# Altium schematic sheet fpga.SchDoc: FPGA
size A4; Organization: GPA & FRYK Industries; DocumentNumber: 3; Revision: REV 0; SheetNumber: 3; SheetTotal: 6
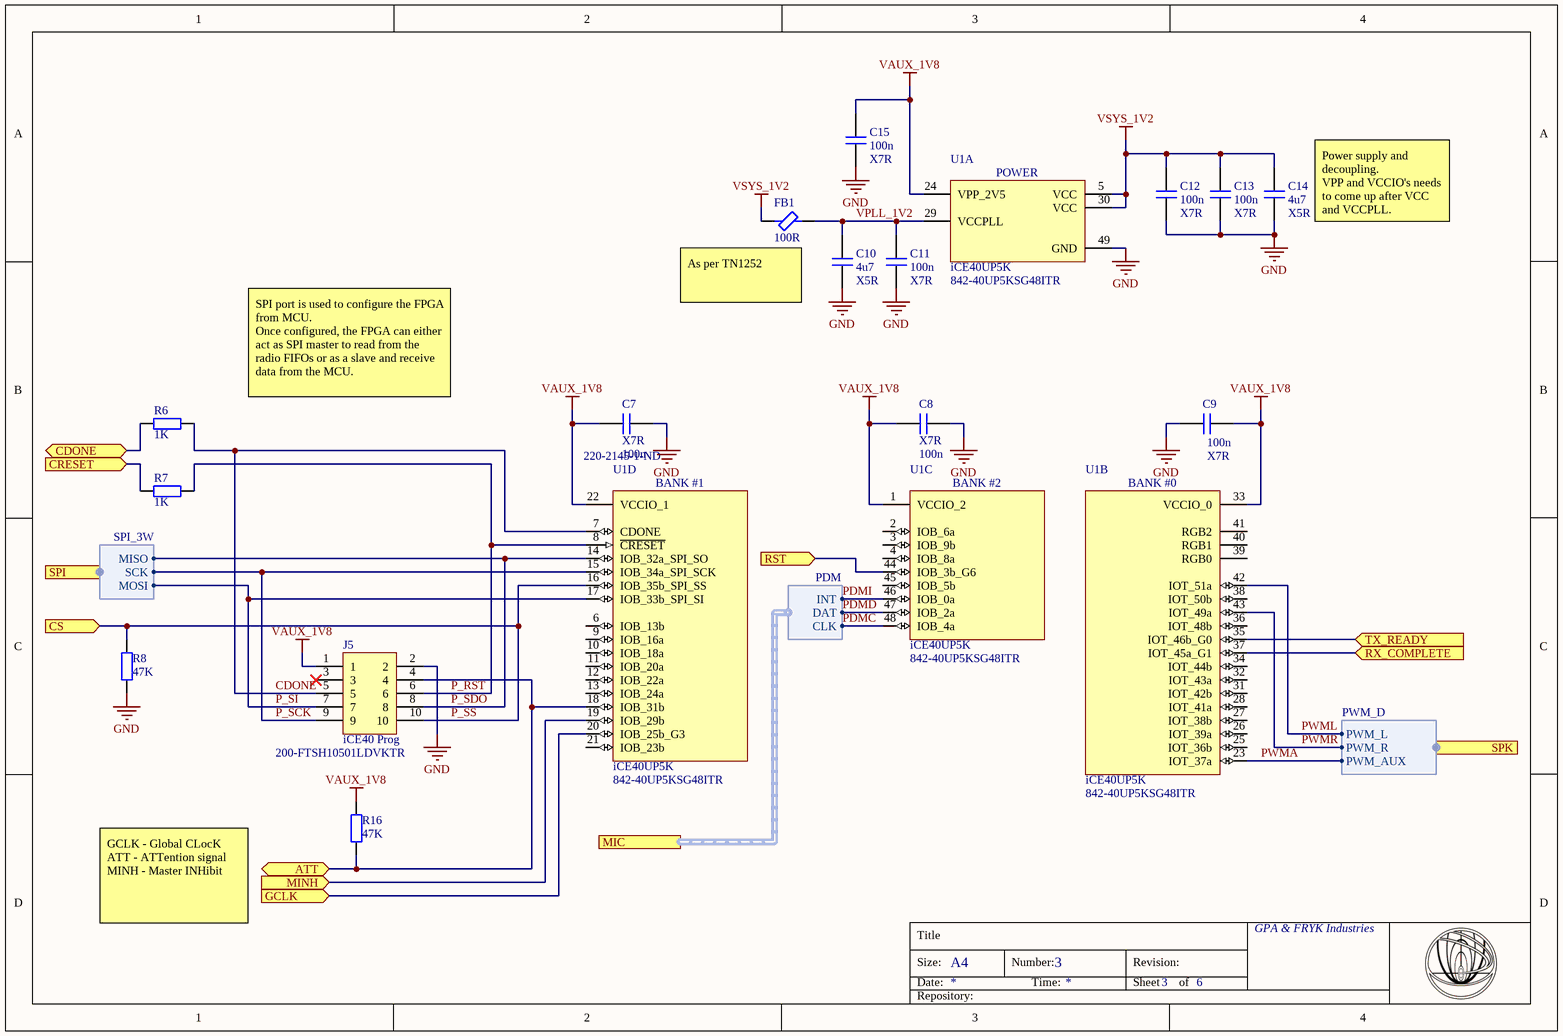
[diagram p0: fpga.SchDoc]

## Parts
C7  value 100n  type: X7R  [CAPC1005X06N]  (hidden comment: cap)
C8  value 100n  type: X7R  [CAPC1005X06N]  (hidden comment: cap)
C9  value 100n  type: X7R  [CAPC1005X06N]  (hidden comment: cap)
C10  value 4u7  type: X5R  [CAPC2012X11N]  (hidden comment: cap)
C11  value 100n  type: X7R  [CAPC1005X06N]  (hidden comment: cap)
C12  value 100n  type: X7R  [CAPC1005X06N]  (hidden comment: cap)
C13  value 100n  type: X7R  [CAPC1005X06N]  (hidden comment: cap)
C14  value 4u7  type: X5R  [CAPC2012X11N]  (hidden comment: cap)
C15  value 100n  type: X7R  [CAPC1005X06N]  (hidden comment: cap)
FB1  value 100R  [INDC1005X06N]  (hidden comment: ferrite)
J5  iCE40 Prog  Supplier Part Number 1: 200-FTSH10501LDVKTR  [hdr_2x5_50mil]
R6  value 1K  [RESC1005X04N]  (hidden comment: res)
R7  value 1K  [RESC1005X04N]  (hidden comment: res)
R8  value 47K  [RESC1005X04N]  (hidden comment: res)
R16  value 47K  [RESC1005X04N]  (hidden comment: res)
U1  iCE40UP5K  Supplier Part Number 1: 842-40UP5KSG48ITR  [QFN127P600-8N-ICE40UP5K]  (parts A,B,C,D of 4)

## Ports
ATT (bidir), CDONE (bidir), CRESET (in), CS (in), GCLK (in), MIC (harness PDM), MINH (in), RST (in), RX_COMPLETE (in), SPI (harness SPI_3W), SPK (harness PWM_D), TX_READY (in)

## Harnesses
SPI_3W: MOSI, MISO, SCK
PWM_D: PWM_R, PWM_L, PWM_AUX
PDM: DAT, CLK, INT

## Nets
GND: C7.1 C8.1 C9.1 C10.1 C11.1 C12.2 C13.2 C14.1 C15.1 J5.2 R8.1 U1.49(GND)
VAUX_1V8: C7.2 C8.2 C9.2 C15.2 J5.1 R16.2 U1.1(VCCIO_2) U1.22(VCCIO_1) U1.24(VPP_2V5) U1.33(VCCIO_0)
VSYS_1V2: C12.1 C13.1 C14.2 FB1.1 U1.5(VCC) U1.30(VCC)
ATT: J5.4 R16.1 U1.18(IOB_31b) ; port ATT
CDONE: J5.5 R6.1 U1.7(CDONE)
CDONE: R6.2 ; port CDONE  [a separate net that carries the same name]
CRESET: R7.2 ; port CRESET
GCLK: U1.20(IOB_25b_G3) ; port GCLK
MINH: U1.19(IOB_29b) ; port MINH
P_RST: J5.6 R7.1 U1.8(~{CRESET})
P_SCK: J5.9 U1.15(IOB_34a_SPI_SCK) ; port SPI.SCK
P_SDO: J5.8 U1.14(IOB_32a_SPI_SO) ; port SPI.MISO
P_SI: J5.7 U1.17(IOB_33b_SPI_SI) ; port SPI.MOSI
P_SS: J5.10 R8.2 U1.16(IOB_35b_SPI_SS) ; port CS
PDMC: U1.48(IOB_4a) ; port MIC.CLK
PDMD: U1.47(IOB_2a) ; port MIC.DAT
PDMI: U1.46(IOB_0a) ; port MIC.INT
PWMA: U1.23(IOT_37a) ; port SPK.PWM_AUX
PWML: U1.42(IOT_51a) ; port SPK.PWM_L
PWMR: U1.43(IOT_49a) ; port SPK.PWM_R
RST: U1.44(IOB_3b_G6) ; port RST
RX_COMPLETE: U1.37(IOT_45a_G1) ; port RX_COMPLETE
TX_READY: U1.35(IOT_46b_G0) ; port TX_READY
VPLL_1V2: C10.2 C11.2 FB1.2 U1.29(VCCPLL)

Not connected (* = marked no-connect by the designer): J5 3*; U1 2(IOB_6a) 3(IOB_9b) 4(IOB_8a) 6(IOB_13b) 9(IOB_16a) 10(IOB_18a) 11(IOB_20a) 12(IOB_22a) 13(IOB_24a) 21(IOB_23b) 25(IOT_36b) 26(IOT_39a) 27(IOT_38b) 28(IOT_41a) 31(IOT_42b) 32(IOT_43a) 34(IOT_44b) 36(IOT_48b) 38(IOT_50b) 39(RGB0) 40(RGB1) 41(RGB2) 45(IOB_5b)

## Notes on the sheet
- (near C14) Power supply and decoupling.
  VPP and VCCIO's needs to come up after VCC and VCCPLL.
- As per TN1252
- SPI port is used to configure the FPGA from MCU.
  Once configured, the FPGA can either act as SPI master to read from the radio FIFOs or as a slave and receive data from the MCU.
- GCLK - Global CLocK
  ATT - ATTention signal
  MINH - Master INHibit
- Title
- Size:
- Date:
- A4
- Number:
- Time:
- Revision:
- Sheet
- of
- Repository:
- (in symbol ice40up5k-sg48, part A) POWER
- (in symbol ice40up5k-sg48, part B) BANK #0
- (in symbol ice40up5k-sg48, part C) BANK #2
- (in symbol ice40up5k-sg48, part D) BANK #1

## Library data of the parts
C7-C15 = cap: Capacitor; voltage: *; #digikey: *; #mouser: *; Supplier 1: Mouser
  C7-C9 C11-C13 C15: Supplier Part Number 1: 81-GCM155R71H103KA5J
  C10 C14: Supplier Part Number 1: 710-885012107009
FB1 = ferrite: Inductor; #digikey: *; #mouser: *; Supplier 1: Mouser; Supplier Part Number 1: 810-MMZ1005S102HT000
J5 = hdr_2x5: 2x5 Header; Supplier 1: Mouser
R6-R8 R16 = res: Resistor; power: *; voltage: *; #digikey: *; #mouser: *
U1 = ice40up5k-sg48: iCE40 UltraPlus family from Lattice Semiconductor is / an ultra-low power FPGA and sensor manager / designed for ultra / - / low power mobile a / pplications, such / as smartphones, tablets and hand-held devices.; ComponentLink1Description: datasheet; ComponentLink1URL: https://www.mouser.se/datasheet/2/225/iCE40%20UltraPlus%20Family%20Data%20Sheet-1149905.pdf; Supplier 1: Mouser